# Altium schematic sheet 40 Pin BS, FAN Connector and Test LEDs.SchDoc
size A4; SheetNumber: 24; SheetTotal: 26
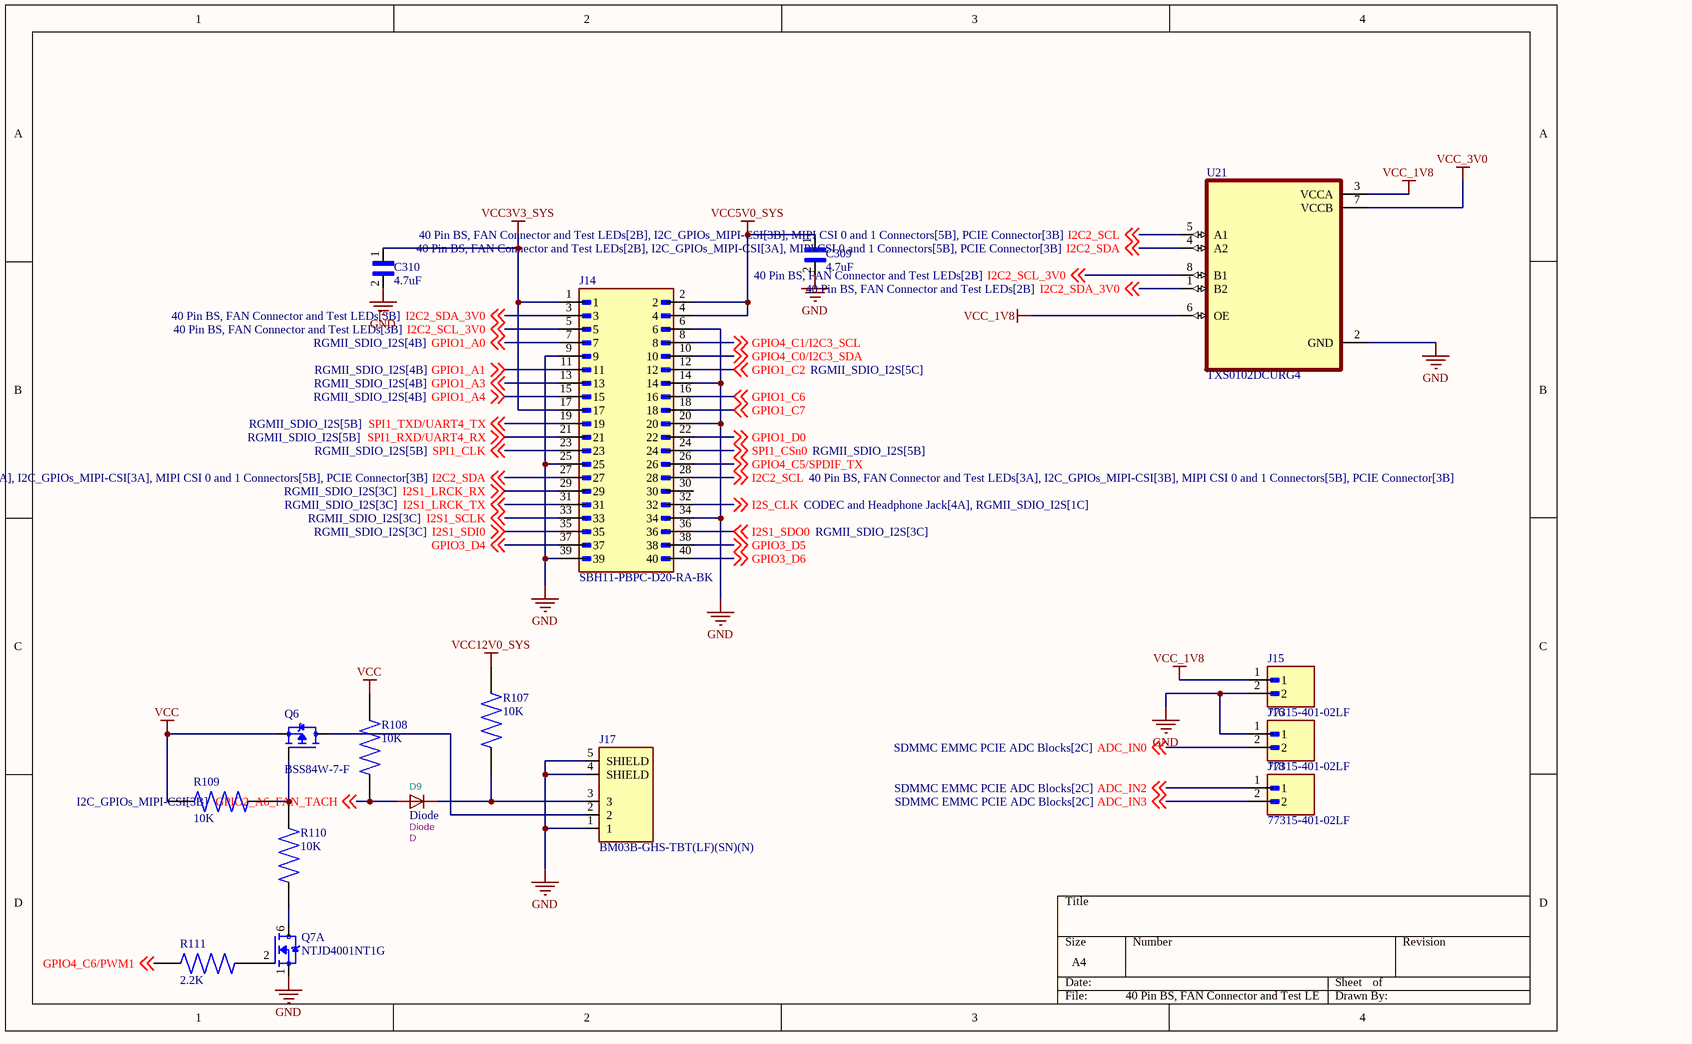
[diagram p0: 40 Pin BS, FAN Connector and Test LEDs.SchDoc]

## Parts
C309  4.7uF  [CAPC6050X350N]
C310  4.7uF  [CAPC6050X350N]
D9  Diode  Reference: D  [SOD-523]
J14  SBH11-PBPC-D20-RA-BK  [SULLINS_SBH11-PBPC-D20-RA-BK]
J15  77315-401-02LF  [AMPHENOL_77315-401-02LF]
J16  77315-401-02LF  [AMPHENOL_77315-401-02LF]
J17  BM03B-GHS-TBT(LF)(SN)(N)  [CONN_BM03B-GHS-TBT(LF)(SN)(N)]
J18  77315-401-02LF  [AMPHENOL_77315-401-02LF]
Q6  BSS84W-7-F  [SOT65P222X110-3N]
Q7  NTJD4001NT1G  [SOT65P210X110-6N]  (part A of 2)
R107  10K  [RES_ERA3ARB103V]
R108  10K  [RES_ERA3ARB103V]
R109  10K  [RES_ERA3ARB103V]
R110  10K  [RES_ERA3ARB103V]
R111  2.2K  [RES_ERA8APB222V]
U21  TXS0102DCURG4  [SOP50P310X90-8N]

## Nets
GND: C309.2 C310.2 J14.6 J14.9 J14.14 J14.20 J14.25 J14.34 J14.39 J15.2 J16.1 J17.1 J17.4(SHIELD) J17.5(SHIELD) Q7.1(S1) U21.2(GND)
VCC: Q6.2(S) R108.2 R109.2
VCC3V3_SYS: C310.1 J14.1 J14.17
VCC5V0_SYS: C309.1 J14.2 J14.4
VCC12V0_SYS: R107.2
VCC_1V8: J15.1 U21.3(VCCA) U21.6(OE)
VCC_3V0: U21.7(VCCB)
ADC_IN0: J16.2 ; off-sheet ADC_IN0
ADC_IN2: J18.1 ; off-sheet ADC_IN2
ADC_IN3: J18.2 ; off-sheet ADC_IN3
GPIO1_A0: J14.7 ; off-sheet GPIO1_A0
GPIO1_A1: J14.11 ; off-sheet GPIO1_A1
GPIO1_A3: J14.13 ; off-sheet GPIO1_A3
GPIO1_A4: J14.15 ; off-sheet GPIO1_A4
GPIO1_C2: J14.12 ; off-sheet GPIO1_C2
GPIO1_C6: J14.16 ; off-sheet GPIO1_C6
GPIO1_C7: J14.18 ; off-sheet GPIO1_C7
GPIO1_D0: J14.22 ; off-sheet GPIO1_D0
GPIO2_A6_FAN_TACH: D9.A R108.1 ; off-sheet GPIO2_A6_FAN_TACH
GPIO3_D4: J14.37 ; off-sheet GPIO3_D4
GPIO3_D5: J14.38 ; off-sheet GPIO3_D5
GPIO3_D6: J14.40 ; off-sheet GPIO3_D6
GPIO4_C0/I2C3_SDA: J14.10 ; off-sheet GPIO4_C0/I2C3_SDA
GPIO4_C1/I2C3_SCL: J14.8 ; off-sheet GPIO4_C1/I2C3_SCL
GPIO4_C5/SPDIF_TX: J14.26 ; off-sheet GPIO4_C5/SPDIF_TX
GPIO4_C6/PWM1: R111.2 ; off-sheet GPIO4_C6/PWM1
I2C2_SCL: J14.28 U21.5(A1) ; off-sheet I2C2_SCL
I2C2_SCL_3V0: J14.5 U21.8(B1) ; off-sheet I2C2_SCL_3V0
I2C2_SDA: J14.27 U21.4(A2) ; off-sheet I2C2_SDA
I2C2_SDA_3V0: J14.3 U21.1(B2) ; off-sheet I2C2_SDA_3V0
I2S1_LRCK_RX: J14.29 ; off-sheet I2S1_LRCK_RX
I2S1_LRCK_TX: J14.31 ; off-sheet I2S1_LRCK_TX
I2S1_SCLK: J14.33 ; off-sheet I2S1_SCLK
I2S1_SDI0: J14.35 ; off-sheet I2S1_SDI0
I2S1_SDO0: J14.36 ; off-sheet I2S1_SDO0
I2S_CLK: J14.32 ; off-sheet I2S_CLK
SPI1_CLK: J14.23 ; off-sheet SPI1_CLK
SPI1_CSn0: J14.24 ; off-sheet SPI1_CSn0
SPI1_RXD/UART4_RX: J14.21 ; off-sheet SPI1_RXD/UART4_RX
SPI1_TXD/UART4_TX: J14.19 ; off-sheet SPI1_TXD/UART4_TX
NetD9_K: D9.K J17.3 R107.1
NetJ17_2: J17.2 Q6.3(D)
NetQ6_1: Q6.1(G) R109.1 R110.1
NetQ7_2: Q7.2(G1) R111.1
NetQ7_6: Q7.6(D1) R110.2

Not connected (* = marked no-connect by the designer): J14 30

## Library data of the parts
C309 C310 = CKG57KX7R2A475M335JJ: CAP CER 4.7UF 100V X7R SMD; MF: TDK; Price: None; Purchase-URL: https://pricing.snapeda.com/search/part/CKG57KX7R2A475M335JJ/?ref=eda; SnapEDA_Link: https://www.snapeda.com/parts/CKG57KX7R2A475M335JJ/TDK/view-part/?ref=snap; Availability: In Stock; Value: *; MP: CKG57KX7R2A475M335JJ; Package: 6050 TDK; Check_prices: https://www.snapeda.com/parts/CKG57KX7R2A475M335JJ/TDK/view-part/?ref=eda
J14 = SBH11-PBPC-D20-RA-BK: Connector Header Through Hole, Right Angle 40 position 0.100 (2.54mm); MF: Sullins Connector; SnapEDA_Link: https://www.snapeda.com/parts/SBH11-PBPC-D20-RA-BK/Sullins+Connector+Solutions/view-part/?ref=snap; Package: None; Value: *; MP: SBH11-PBPC-D20-RA-BK; Check_prices: https://www.snapeda.com/parts/SBH11-PBPC-D20-RA-BK/Sullins+Connector+Solutions/view-part/?ref=eda
J17 = BM03B-GHS-TBT(LF)(SN)(N): Connector Header Surface Mount 3 position 0.049 (1.25mm); MF: JST Sales; SnapEDA_Link: https://www.snapeda.com/parts/BM03B-GHS-TBT(LF)(SN)(N)/JST/view-part/?ref=snap; Package: None; Value: *; MP: BM03B-GHS-TBT(LF)(SN)(N); Check_prices: https://www.snapeda.com/parts/BM03B-GHS-TBT(LF)(SN)(N)/JST/view-part/?ref=eda
Q6 = BSS84W-7-F: P-Channel 50 V 130mA (Ta) 200mW (Ta) Surface Mount SOT-323; MF: Diodes Inc.; SnapEDA_Link: https://www.snapeda.com/parts/BSS84W-7-F/Diodes+Inc./view-part/?ref=snap; Availability: In Stock; Check_prices: https://www.snapeda.com/parts/BSS84W-7-F/Diodes+Inc./view-part/?ref=eda; MP: BSS84W-7-F; Price: None; Purchase-URL: https://pricing.snapeda.com/search/part/BSS84W-7-F/?ref=eda; Package: SOT-323 Diodes Inc.; Value: *
Q7 = NTJD4001NT1G: Mosfet Array 2 N-Channel (Dual) 30V 250mA 272mW Surface Mount SC-88/SC70-6/SOT-363; MF: ON Semiconductor; SnapEDA_Link: https://www.snapeda.com/parts/NTJD4001NT1G/Onsemi/view-part/?ref=snap; Package: SC-88-6 ON Semiconductor; Value: *; MP: NTJD4001NT1G; Check_prices: https://www.snapeda.com/parts/NTJD4001NT1G/Onsemi/view-part/?ref=eda
R107-R110 = ERA3ARB103V: MP: ERA3ARB103V; Availability: Unavailable; Package: None; Value: *; Price: None
R111 = ERA8APB222V: Availability: Unavailable; Price: None; Package: None; MP: ERA8APB222V; Value: *
U21 = TXS0102DCURG4: 2-Bit Bidirectional Voltage-Level Shifter for Open-Drain and Push-Pull Application; MF: Texas Instruments; SnapEDA_Link: https://www.snapeda.com/parts/TXS0102DCURG4/Texas+Instruments/view-part/?ref=snap; Package: VSSOP-8 Texas Instruments; Value: *; MP: TXS0102DCURG4; Check_prices: https://www.snapeda.com/parts/TXS0102DCURG4/Texas+Instruments/view-part/?ref=eda
D9 = Diode: Datasheet: https://diotec.com/de/produktliste/D.html; ki_keywords: Diode; ki_description: Diode; Value: Diode
J15 J16 J18 = 77315-401-02LF: Package: None; Price: None; Value: *; MP: 77315-401-02LF; Availability: Unavailable